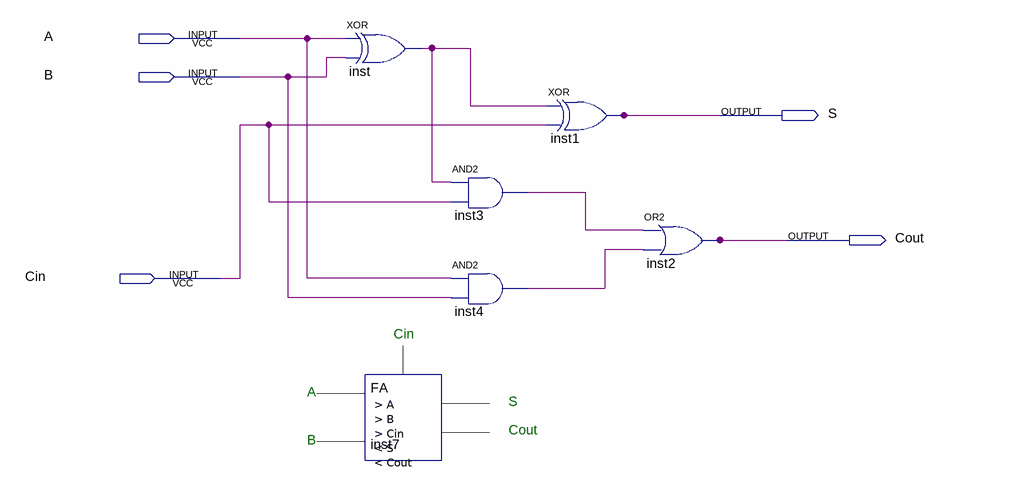
[diagram p0: schematic sheet]
// Quartus schematic full_adder.bdf as structural Verilog: 6 symbols, 5 pins
module full_adder (
  input  A,
  input  B,
  input  Cin,
  output S,
  output Cout
);

  wire inst3_out, inst4_out, inst_out;

  xor inst (inst_out, A, B);
  FA inst7 ();  // open: A, B, Cin, S, Cout
  and inst3 (inst3_out, inst_out, Cin);
  and inst4 (inst4_out, A, B);
  xor inst1 (S, inst_out, Cin);
  or inst2 (Cout, inst3_out, inst4_out);

  // Notes on the sheet:
  //   Cin
  //   A
  //   S
  //   Cout
  //   B
endmodule
